# Altium schematic sheet [02] - STARTER PAGE.SchDoc
size A3; DocumentNumber: 2; SheetNumber: 2; SheetTotal: 12
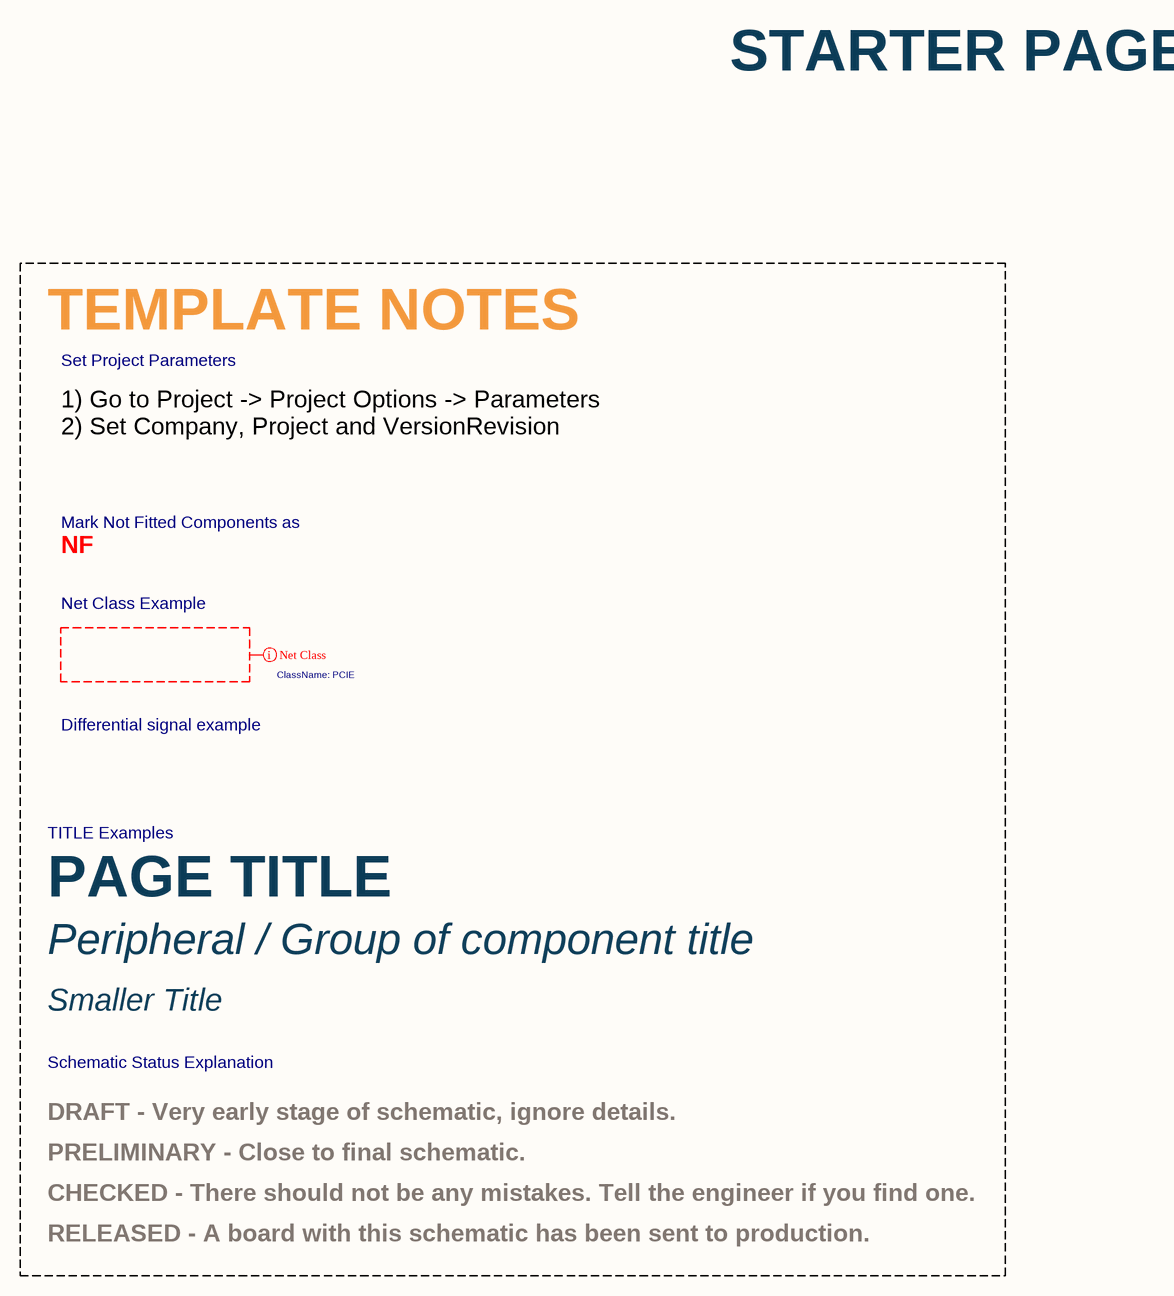
[diagram p0: [02] - STARTER PAGE.SchDoc]

## Layout directives
net class PCIE: (no net found under the mark)

## Notes on the sheet
- STARTER PAGE
- TEMPLATE NOTES
- Set Project Parameters
- 1) Go to Project -> Project Options -> Parameters
  2) Set Company, Project and VersionRevision
- NF
- Mark Not Fitted Components as
- Net Class Example
- Differential signal example
- TITLE Examples
- PAGE TITLE
- Peripheral / Group of component title
- Smaller Title
- Schematic Status Explanation
- DRAFT - Very early stage of schematic, ignore details.
- PRELIMINARY - Close to final schematic.
- RELEASED - A board with this schematic has been sent to production.
- CHECKED - There should not be any mistakes. Tell the engineer if you find one.
- Date
- Name
- Product
- Variante:
- Editor
- Check
- Ref.
- Schematic
- File
- PCB-Number
- Rev.
- Description
- Sheet Size
- A3
- Sheet:
- /